# EAGLE schematic SI4844_LCD16x02 (EAGLE 9.6.2)
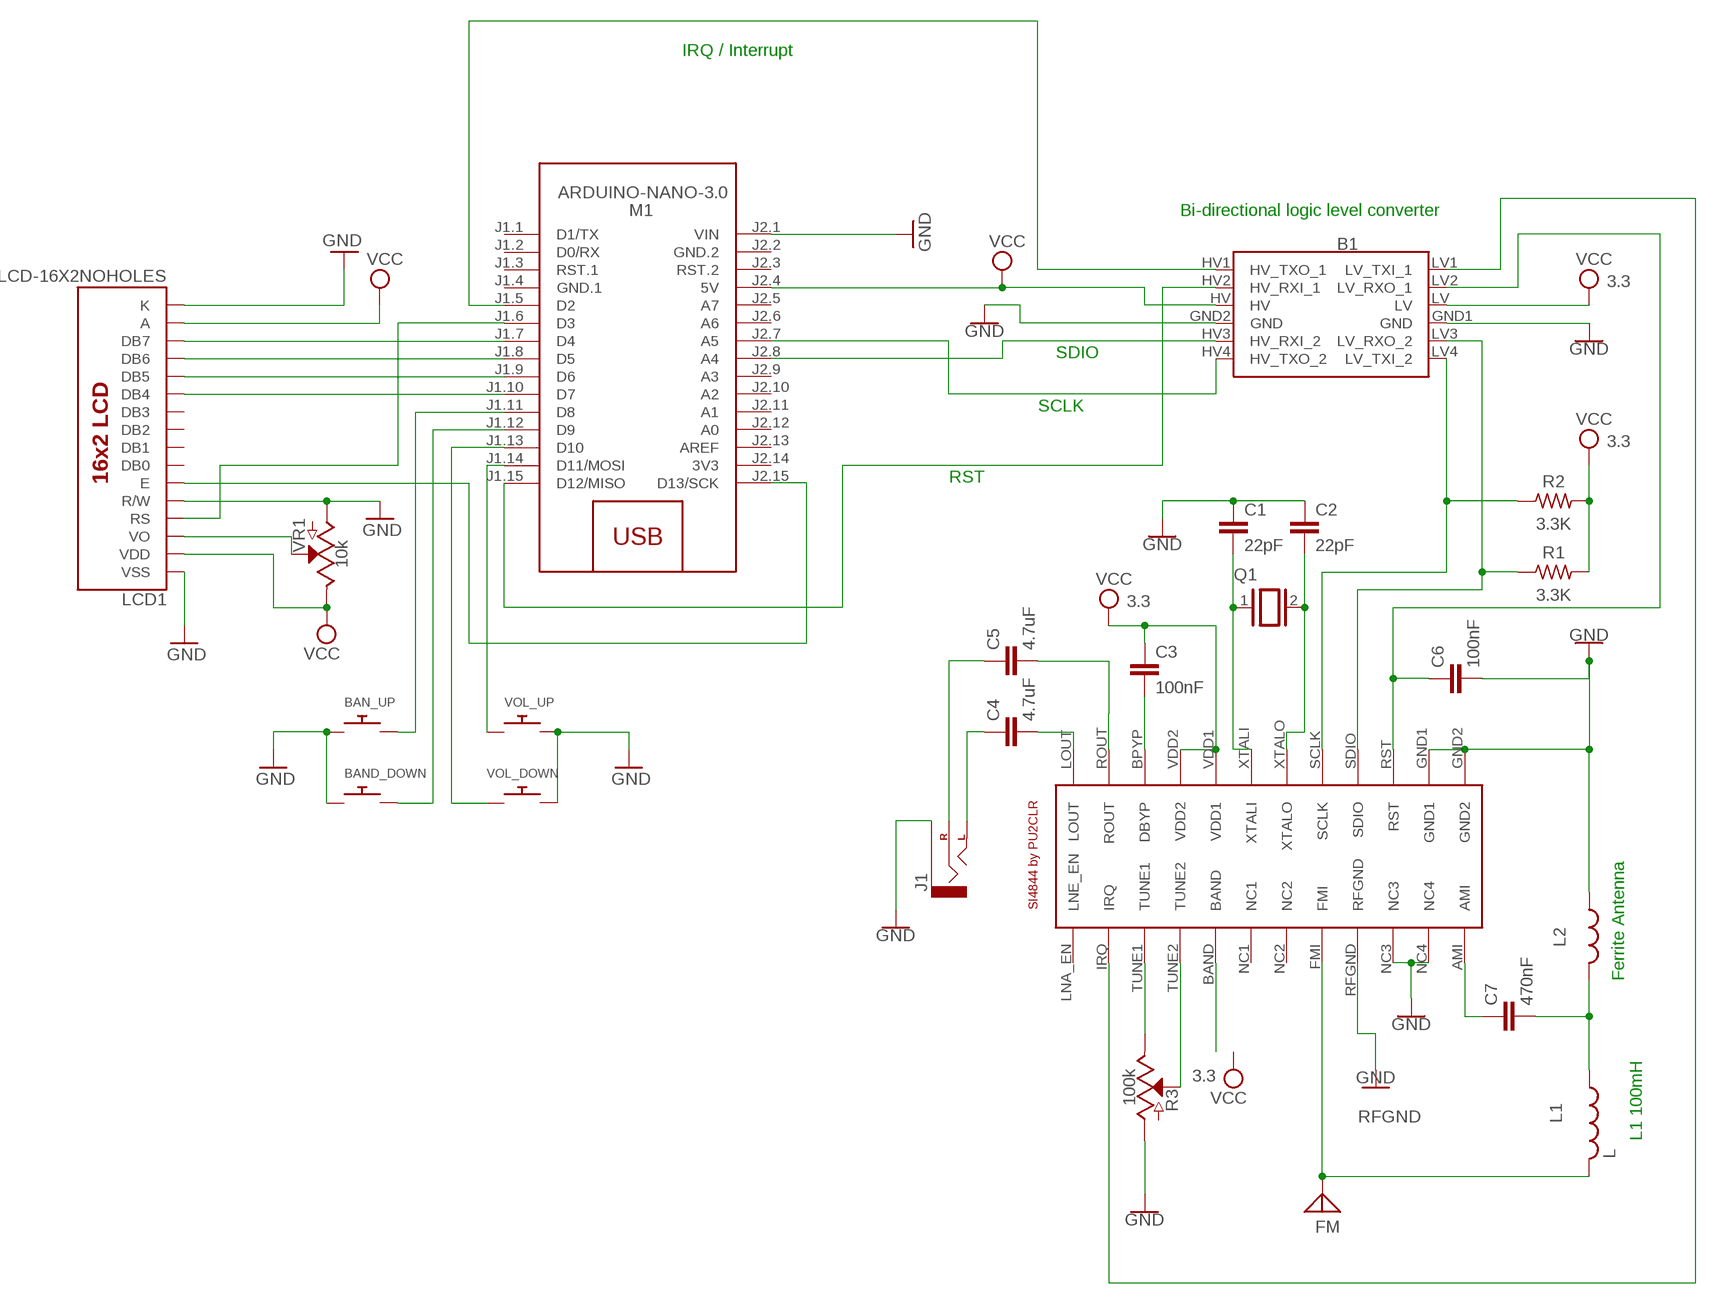
[diagram p0: schematic, sheet 1]

## Parts
B1  SPARKFUN_LOGIC_LEVEL_CONVERTERLOCK  [SPARKFUN_LOGIC_LEVEL_CONVERTER_LOCK]
BAN_UP  SWITCH_PUSHBUTTONC&K_KSS  [BTN_CK_KSS]
BAND_DOWN  SWITCH_PUSHBUTTONC&K_KSS  [BTN_CK_KSS]
C1  22pF  C2,5-3  [C2.5-3]
C2  22pF  C2,5-3  [C2.5-3]
C3  100nF  C2,5-3  [C2.5-3]
C4  4.7uF  C2,5-3  [C2.5-3]
C5  4.7uF  C2,5-3  [C2.5-3]
C6  100nF  C2,5-3  [C2.5-3]
C7  470nF  C2,5-3  [C2.5-3]
FM  ANTENNA  [PAD-01]
J1  AUDIO_JACK_2.5MMSPECIAL_POGO_PINS  [STEREOJACK2.5MM_SPECIAL_POGOPINS]
L1  L  [6000]
L2  L  (no package)
LCD1  LCD-16X2NOHOLES  [LCD-16X2_NOHOLESNOSILK]
M1  ARDUINO-NANO-3.0  [ARDUINO-NANO-3.0]
Q1  XTAL  [Q]
R1  3.3K  R-US_AXIAL-7.2MM-PITCH  [RESAD724W46L381D178B]
R2  3.3K  R-US_AXIAL-7.2MM-PITCH  [RESAD724W46L381D178B]
R3  100k  POTENTIOMETER-PTH-9MM-1/20W-20%  [POT-PTH-ALPS]
SI1  SI4844  [SSOP24]
VOL_DOWN  SWITCH_PUSHBUTTONC&K_KSS  [BTN_CK_KSS]
VOL_UP  SWITCH_PUSHBUTTONC&K_KSS  [BTN_CK_KSS]
VR1  10k  POTENTIOMETER-PTH-9MM-1/20W-20%  [POT-PTH-ALPS]

## Nets
GND: B1.GND1(GND) B1.GND2(GND) BAN_UP.P$1 BAND_DOWN.P$1 C1.1 C2.1 C6.2 J1.RING1(SLEEVE) L2.1 LCD1.1(VSS) LCD1.5(R/W) LCD1.16(K) M1.J2.1(VIN) R3.P$3(A) SI1.GND1 SI1.GND2 SI1.NC3 SI1.NC4 SI1.RFGND VOL_DOWN.P$2 VOL_UP.P$2 VR1.P$3(A)
N$1: LCD1.14(DB7) M1.J1.7(D4)
N$2: LCD1.13(DB6) M1.J1.8(D5)
N$3: LCD1.12(DB5) M1.J1.9(D6)
N$4: LCD1.11(DB4) M1.J1.10(D7)
N$5: BAN_UP.P$2 M1.J1.11(D8)
N$6: LCD1.6(E) M1.J2.15(D13/SCK)
N$7: BAND_DOWN.P$2 M1.J1.12(D9)
N$8: M1.J1.13(D10) VOL_DOWN.P$1
N$9: M1.J1.14(D11/MOSI) VOL_UP.P$1
N$10: LCD1.3(VO) VR1.P$2(S)
N$11: LCD1.4(RS) M1.J1.6(D3)
N$12: C1.2 Q1.1 SI1.XTALI
N$13: C2.2 Q1.2 SI1.XTALO
N$14: FM.1 L1.2 SI1.FMI
N$15: C7.1 SI1.AMI
N$16: C7.2 L1.1 L2.2
N$17: C5.1 J1.TIP(RIGHT)
N$18: C4.1 J1.SHIELD(LEFT)
N$19: B1.LV4(LV_TXI_2) R2.1 SI1.SCLK
N$20: C3.2 SI1.BPYP(DBYP)
N$21: B1.LV3(LV_RXO_2) R1.1 SI1.SDIO
N$22: B1.LV2(LV_RXO_1) C6.1 SI1.RST
N$23: B1.HV4(HV_TXO_2) M1.J2.7(A5)
N$24: B1.HV3(HV_RXI_2) M1.J2.8(A4)
N$25: B1.LV1(LV_TXI_1) SI1.IRQ
N$26: B1.HV1(HV_TXO_1) M1.J1.5(D2)
N$27: B1.HV2(HV_RXI_1) M1.J1.15(D12/MISO)
N$28: R3.P$1(E) SI1.TUNE1
N$29: R3.P$2(S) SI1.TUNE2
N$30: SI1.BAND
N$31: C4.2 SI1.LOUT
N$32: C5.2 SI1.ROUT
VCC: B1.HV B1.LV C3.1 LCD1.2(VDD) LCD1.15(A) M1.J2.4(5V) R1.2 R2.2 SI1.VDD1 SI1.VDD2 VR1.P$1(E)
Unconnected: LCD1.7(DB0) LCD1.8(DB1) LCD1.9(DB2) LCD1.10(DB3) M1.J1.1(D1/TX) M1.J1.2(D0/RX) M1.J1.3(RST.1) M1.J2.3(RST.2) M1.J2.5(A7) M1.J2.6(A6) M1.J2.9(A3) M1.J2.10(A2) M1.J2.11(A1) M1.J2.12(A0) M1.J2.13(AREF) SI1.LNA_EN(LNE_EN) SI1.NC1 SI1.NC2

## Notes on the sheet
- IRQ / Interrupt
- Bi-directional logic level converter
- SDIO
- SCLK
- RST
- Ferrite Antenna
- L1 100mH

## Power pins joined to a net without a drawn wire
3V3: M1.J2.14(3V3)
GND.1: M1.J1.4(GND.1)
GND.2: M1.J2.2(GND.2)

## Library data of the parts
B1 = SparkFun-Boards:SPARKFUN_LOGIC_LEVEL_CONVERTER: SparkFun Logic Level Converter -Bi-Directional This is the mechnical outline for the 3.3V - 5V bi directional logic level converter. *Note, the "LOCK" Package has the header pins staggered by an offset of 5 mils (off center line), so that when you slide a row of standard 0.1" headers into the PTH pads, it will hold position vertically. See the follwing turorial for more information on this type of special footprints: Sneaky Footprints <https://www.sparkfun.com/tutorials/114> SparkFun Products: SparkFun Logic Level Converter - Bi-Directional <https://www.sparkfun.com/products/12009>
BAN_UP BAND_DOWN VOL_DOWN VOL_UP = adafruit:SWITCH_PUSHBUTTON: Buttons SOFTTOUCHSMD_SJ - Soft touch temporary push button (Super Junk Akihabara) Compatible with SKPMANE010 [Mouser: 688-SKPMAN] C&K_KSS = Digikey: KSS221GLFS
C1-C7 = capacitor-wima:C: CAPACITOR naming: grid - package width
FM = discrete:ANTENNA: Antenna
J1 = SparkFun-Connectors:AUDIO_JACK_2.5MM: Audio Jack 2.5mm variants of PTH and SMT audio jacks. SparkFun Products: SparkFun PicoBoard <https://www.sparkfun.com/products/11888>- 2.5mm SMD
L1 = adafruit:L
L2 = ngspice-simulation:L: INDUCTOR
LCD1 = SparkFun-Displays:LCD-16X2: Standard text-only 16x2 parallel input LCD Basic 16 character by 2 line display. Typically utilizes the extremely common HD44780 parallel interface chipset SparkFun Products: Basic 16x2 Green <https://www.sparkfun.com/products/255> Basic 8x2 Green <https://www.sparkfun.com/products/11122>; SF_ID: LCD-00255
M1 = diy-modules:ARDUINO-NANO-3.0: Arduino Nano 3.0 and compatible devices More details available here: https://www.arduino.cc/en/Main/ArduinoBoardNano Click here to find device on ebay.com <http://www.ebay.com/sch/arduino+nano>
Q1 = special:XTAL: CRYSTAL
R1 R2 = Resistor:R-US: Resistor Fixed - ANSI; CATEGORY: Resistor; SUB-CATEGORY: Fixed
R3 = SparkFun-Resistors:POTENTIOMETER: Potentiometer (Pot) Three-terminal potentiometers, with an adjustable wiper and two adjustable resistors. A pot can be used to create a configurable voltage divider, or as a variable resistor. Variants ALPS_POT and ALPS_POT_KIT - PTH, breadboard compatible, 9mm square pots Rotary Potentiometer - Linear (10k ohm) <https://www.sparkfun.com/products/9288> (COM-09288) The KIT variant exposes copper on only one side of the PTH pad, so the part can only be assembled on one side of the PCB. Useful for beginner soldering kits.; PROD_ID: RES-09177; SF_SKU: COM-09288; VALUE: 10k
SI1 = SI4844_PU2CLR:SI4844
VR1 = SparkFun-Resistors:POTENTIOMETER: Potentiometer (Pot) Three-terminal potentiometers, with an adjustable wiper and two adjustable resistors. A pot can be used to create a configurable voltage divider, or as a variable resistor. Variants ALPS_POT and ALPS_POT_KIT - PTH, breadboard compatible, 9mm square pots Rotary Potentiometer - Linear (10k ohm) <https://www.sparkfun.com/products/9288> (COM-09288) The KIT variant exposes copper on only one side of the PTH pad, so the part can only be assembled on one side of the PCB. Useful for beginner soldering kits.; PROD_ID: RES-09177; SF_SKU: COM-09288